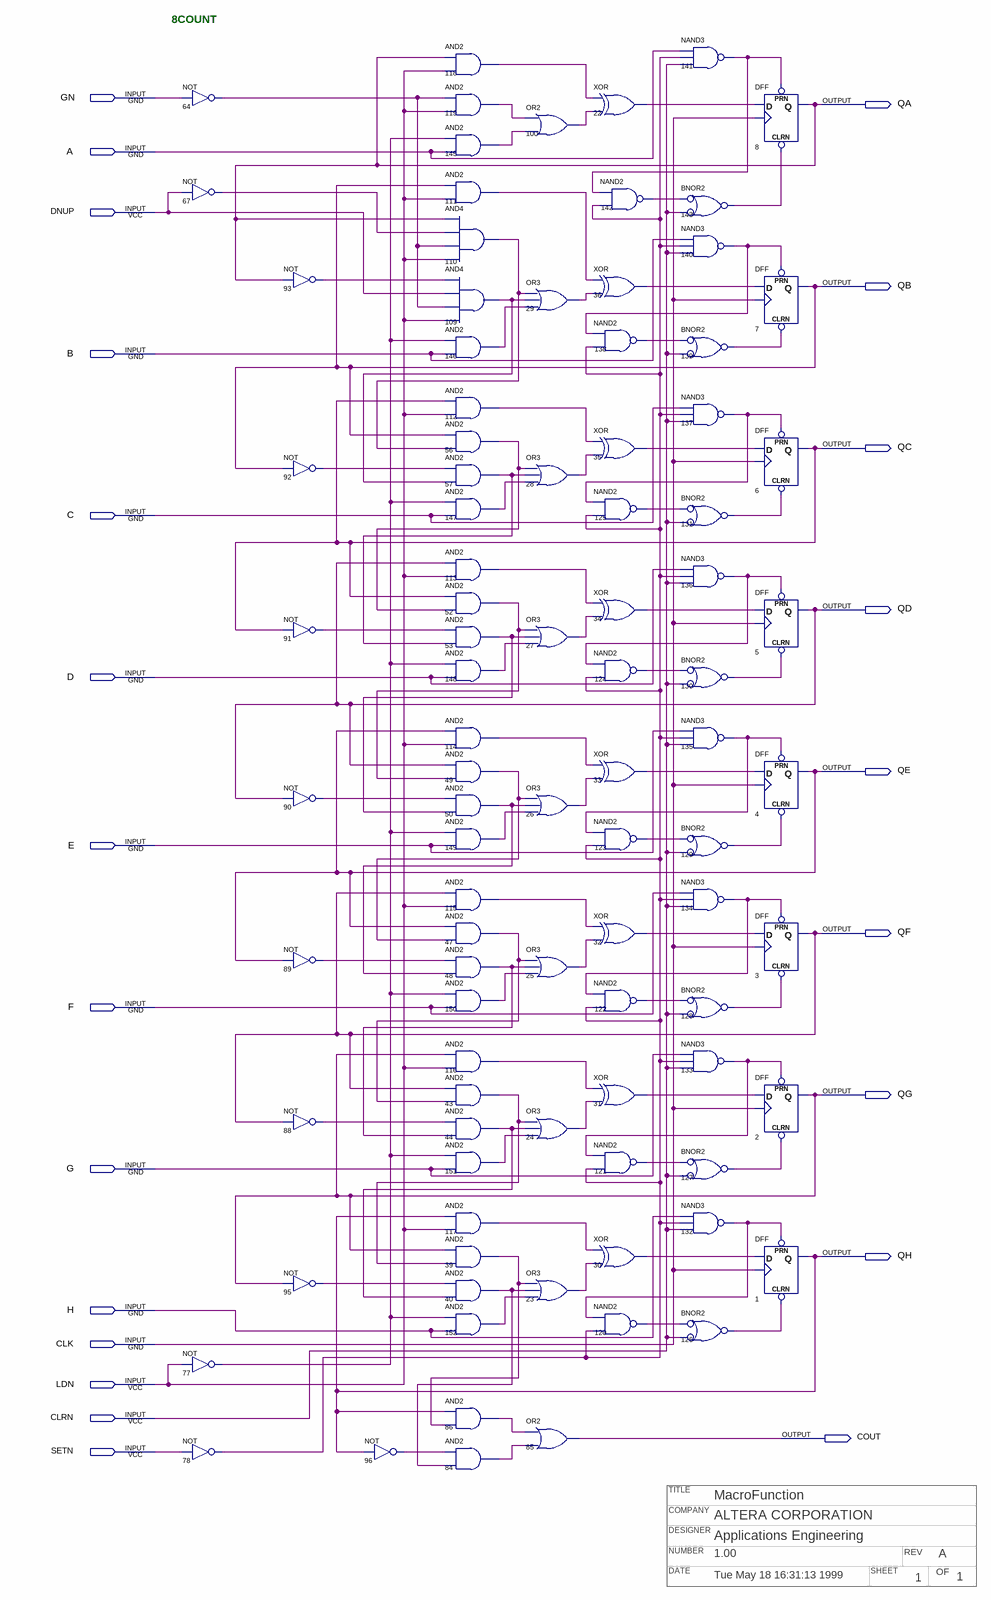
[diagram p0: schematic sheet]
// Quartus schematic p8count.bdf as structural Verilog: 94 symbols, 23 pins
// Title block: TITLE: MacroFunction; COMPANY: ALTERA CORPORATION; DESIGNER: Applications Engineering; NUMBER: 1.00; REV: A; DATE: Tue May 18 16:31:13 1999; SHEET: 1; OF: 1
module p8count (
  input  GN,
  input  A,
  input  DNUP,
  input  B,
  input  C,
  input  D,
  input  E,
  input  F,
  input  G,
  input  H,
  input  CLK,
  input  LDN,
  input  CLRN,
  input  SETN,
  output QA,
  output QB,
  output QC,
  output QD,
  output QE,
  output QF,
  output QG,
  output QH,
  output COUT
);

  wire n22_out, n23_out, n24_out, n25_out, n26_out, n27_out, n28_out, n29_out, n30_out, n31_out, n32_out,
       n33_out, n34_out, n35_out, n36_out, n39_out, n40_out, n43_out, n44_out, n47_out, n48_out, n49_out,
       n50_out, n52_out, n53_out, n56_out, n57_out, n64_out, n67_out, n77_out, n78_out, n84_out, n86_out,
       n88_out, n89_out, n90_out, n91_out, n92_out, n93_out, n95_out, n96_out, n100_out, n109_out, n110_out,
       n111_out, n112_out, n113_out, n114_out, n115_out, n116_out, n117_out, n118_out, n119_out, n120_out,
       n121_out, n122_out, n123_out, n124_out, n125_out, n126_out, n127_out, n128_out, n129_out, n130_out,
       n131_out, n132_out, n133_out, n134_out, n135_out, n136_out, n137_out, n138_out, n139_out, n140_out,
       n141_out, n142_out, n143_out, n145_out, n146_out, n147_out, n148_out, n149_out, n150_out, n151_out,
       n152_out;

  not u_64 (n64_out, GN);
  not u_67 (n67_out, DNUP);
  not u_77 (n77_out, LDN);
  not u_78 (n78_out, SETN);
  not u_93 (n93_out, QA);
  not u_92 (n92_out, QB);
  not u_91 (n91_out, QC);
  not u_90 (n90_out, QD);
  not u_89 (n89_out, QE);
  not u_88 (n88_out, QF);
  not u_95 (n95_out, QG);
  not u_96 (n96_out, QH);
  and u_118 (n118_out, QA, LDN);
  and u_119 (n119_out, n64_out, LDN);
  and u_145 (n145_out, n77_out, A);
  and u_111 (n111_out, QB, LDN);
  and u_110 (n110_out, QA, n67_out, n64_out, LDN);
  and u_109 (n109_out, n93_out, DNUP, n64_out, LDN);
  and u_146 (n146_out, n77_out, B);
  and u_112 (n112_out, QC, LDN);
  and u_56 (n56_out, QB, n110_out);
  and u_57 (n57_out, n92_out, n109_out);
  and u_147 (n147_out, n77_out, C);
  and u_113 (n113_out, QD, LDN);
  and u_52 (n52_out, QC, n56_out);
  and u_53 (n53_out, n91_out, n57_out);
  and u_148 (n148_out, n77_out, D);
  and u_114 (n114_out, QE, LDN);
  and u_49 (n49_out, QD, n52_out);
  and u_50 (n50_out, n90_out, n53_out);
  and u_149 (n149_out, n77_out, E);
  and u_115 (n115_out, QF, LDN);
  and u_47 (n47_out, QE, n49_out);
  and u_48 (n48_out, n89_out, n50_out);
  and u_150 (n150_out, n77_out, F);
  and u_116 (n116_out, QG, LDN);
  and u_43 (n43_out, QF, n47_out);
  and u_44 (n44_out, n88_out, n48_out);
  and u_151 (n151_out, n77_out, G);
  and u_117 (n117_out, QH, LDN);
  and u_39 (n39_out, QG, n43_out);
  and u_40 (n40_out, n95_out, n44_out);
  and u_152 (n152_out, n77_out, H);
  and u_86 (n86_out, QH, n39_out);
  and u_84 (n84_out, n96_out, n40_out);
  or u_100 (n100_out, n119_out, n145_out);
  or u_29 (n29_out, n110_out, n109_out, n146_out);
  or u_28 (n28_out, n56_out, n57_out, n147_out);
  or u_27 (n27_out, n52_out, n53_out, n148_out);
  or u_26 (n26_out, n49_out, n50_out, n149_out);
  or u_25 (n25_out, n47_out, n48_out, n150_out);
  or u_24 (n24_out, n43_out, n44_out, n151_out);
  or u_23 (n23_out, n39_out, n40_out, n152_out);
  or u_85 (COUT, n86_out, n84_out);
  xor u_22 (n22_out, n118_out, n100_out);
  nand u_142 (n142_out, n141_out, n78_out);
  xor u_36 (n36_out, n111_out, n29_out);
  nand u_138 (n138_out, n140_out, n78_out);
  xor u_35 (n35_out, n112_out, n28_out);
  nand u_125 (n125_out, n137_out, n78_out);
  xor u_34 (n34_out, n113_out, n27_out);
  nand u_124 (n124_out, n136_out, n78_out);
  xor u_33 (n33_out, n114_out, n26_out);
  nand u_123 (n123_out, n135_out, n78_out);
  xor u_32 (n32_out, n115_out, n25_out);
  nand u_122 (n122_out, n134_out, n78_out);
  xor u_31 (n31_out, n116_out, n24_out);
  nand u_121 (n121_out, n133_out, n78_out);
  xor u_30 (n30_out, n117_out, n23_out);
  nand u_120 (n120_out, n132_out, n78_out);
  nand u_141 (n141_out, A, n78_out, CLRN);
  nor u_143 (n143_out, ~n142_out, ~CLRN);  // BNOR2
  nand u_140 (n140_out, B, n78_out, CLRN);
  nor u_139 (n139_out, ~n138_out, ~CLRN);  // BNOR2
  nand u_137 (n137_out, C, n78_out, CLRN);
  nor u_131 (n131_out, ~n125_out, ~CLRN);  // BNOR2
  nand u_136 (n136_out, D, n78_out, CLRN);
  nor u_130 (n130_out, ~n124_out, ~CLRN);  // BNOR2
  nand u_135 (n135_out, E, n78_out, CLRN);
  nor u_129 (n129_out, ~n123_out, ~CLRN);  // BNOR2
  nand u_134 (n134_out, F, n78_out, CLRN);
  nor u_128 (n128_out, ~n122_out, ~CLRN);  // BNOR2
  nand u_133 (n133_out, G, n78_out, CLRN);
  nor u_127 (n127_out, ~n121_out, ~CLRN);  // BNOR2
  nand u_132 (n132_out, H, n78_out, CLRN);
  nor u_126 (n126_out, ~n120_out, ~CLRN);  // BNOR2
  DFF u_8 (.CLRN(n143_out), .CLK(CLK), .D(n22_out), .PRN(n141_out), .Q(QA));
  DFF u_7 (.CLRN(n139_out), .CLK(CLK), .D(n36_out), .PRN(n140_out), .Q(QB));
  DFF u_6 (.CLRN(n131_out), .CLK(CLK), .D(n35_out), .PRN(n137_out), .Q(QC));
  DFF u_5 (.CLRN(n130_out), .CLK(CLK), .D(n34_out), .PRN(n136_out), .Q(QD));
  DFF u_4 (.CLRN(n129_out), .CLK(CLK), .D(n33_out), .PRN(n135_out), .Q(QE));
  DFF u_3 (.CLRN(n128_out), .CLK(CLK), .D(n32_out), .PRN(n134_out), .Q(QF));
  DFF u_2 (.CLRN(n127_out), .CLK(CLK), .D(n31_out), .PRN(n133_out), .Q(QG));
  DFF u_1 (.CLRN(n126_out), .CLK(CLK), .D(n30_out), .PRN(n132_out), .Q(QH));

  // Notes on the sheet:
  //   8COUNT
endmodule
